# EAGLE design XT-01_Power (EAGLE 9.5.1)
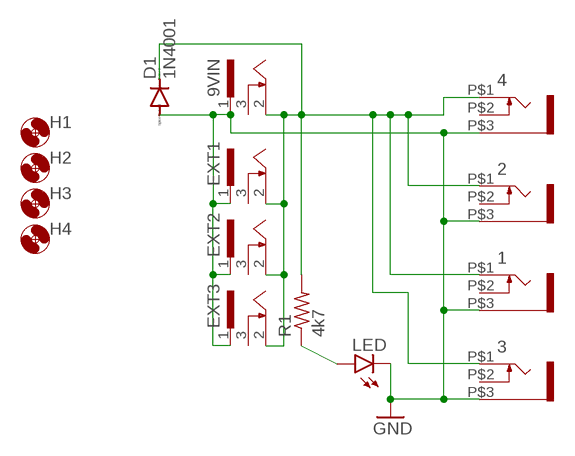
[diagram p0: schematic, sheet 1]

## Parts
1  WQP-PJ301M-12_JACK  [WQP-PJ301M-12_JACK]
2  WQP-PJ301M-12_JACK  [WQP-PJ301M-12_JACK]
3  WQP-PJ301M-12_JACK  [WQP-PJ301M-12_JACK]
4  WQP-PJ301M-12_JACK  [WQP-PJ301M-12_JACK]
9VIN  SCD-014A  [SCD-014-A]
D1  1N4001  1N4004  [DO41-10]
EXT1  SCD-014A  [SCD-014-A]
EXT2  SCD-014A  [SCD-014-A]
EXT3  SCD-014A  [SCD-014-A]
H1  MOUNT-HOLE3.0  [3,0]
H2  MOUNT-HOLE3.0  [3,0]
H3  MOUNT-HOLE3.0  [3,0]
H4  MOUNT-HOLE3.0  [3,0]
LED  LED3MM  [LED3MM]
R1  4k7  R-US_0207/7  [0207/7]

## Nets
GND: 1.P$3 2.P$3 3.P$3 4.P$3 9VIN.1 D1.A EXT1.1 EXT2.1 EXT3.1 LED.K(C)
N$1: LED.A R1.1
N$2: 1.P$1 2.P$1 3.P$1 4.P$1 9VIN.2 D1.C EXT1.2 EXT2.2 EXT3.2 R1.2
Unconnected: 1.P$2 2.P$2 3.P$2 4.P$2 9VIN.3 EXT1.3 EXT2.3 EXT3.3

## Library data of the parts
1-4 = thonkiconn:WQP-PJ301M-12_JACK
9VIN EXT1-EXT3 = con-shiua-chyuan:SCD-014A: Power Jack 2.5mm; OC_FARNELL: unknown; OC_NEWARK: unknown
D1 = diode:1N4004: DIODE general purpose rectifier, 1 A
H1-H4 = holes:MOUNT-HOLE: MOUNTING HOLE with drill center marker
LED = led:LED: LED OSRAM: - CHIPLED LG R971, LG N971, LY N971, LG Q971, LY Q971, LO R971, LY R971 LH N974, LH R974 LS Q976, LO Q976, LY Q976 LO Q996 - Hyper CHIPLED LW Q18S LB Q993, LB Q99A, LB R99A - SideLED LS A670, LO A670, LY A670, LG A670, LP A670 LB A673, LV A673, LT A673, LW A673 LH A674 LY A675 LS A676, LA A676, LO A676, LY A676, LW A676 LS A679, LY A679, LG A679 - Hyper Micro SIDELED® LS Y876, LA Y876, LO Y876, LY Y876 LT Y87S - SmartLED LW L88C, LW L88S LB L89C, LB L89S, LG L890 LS L89K, LO L89K, LY L89K LS L896, LA L896, LO L896, LY L896 - TOPLED LS T670, LO T670, LY T670, LG T670, LP T670 LSG T670, LSP T670, LSY T670, LOP T670, LYG T670 LG T671, LOG T671, LSG T671 LB T673, LV T673, LT T673, LW T673 LH T674 LS T676, LA T676, LO T676, LY T676, LB T676, LH T676, LSB T676, LW T676 LB T67C, LV T67C, LT T67C, LS T67K, LO T67K, LY T67K, LW E67C LS E67B, LA E67B, LO E67B, LY E67B, LB E67C, LV E67C, LT E67C LW T67C LS T679, LY T679, LG T679 LS T770, LO T770, LY T770, LG T770, LP T770 LB T773, LV T773, LT T773, LW T773 LH T774 LS E675, LA E675, LY E675, LS T675 LS T776, LA T776, LO T776, LY T776, LB T776 LHGB T686 LT T68C, LB T68C - Hyper Mini TOPLED® LB M676 - Mini TOPLED Santana® LG M470 LS M47K, LO M47K, LY M47K Source: http://www.osram.convergy.de LUXEON: - LUMILED® LXK2-PW12-R00, LXK2-PW12-S00, LXK2-PW14-U00, LXK2-PW14-V00 LXK2-PM12-R00, LXK2-PM12-S00, LXK2-PM14-U00 LXK2-PE12-Q00, LXK2-PE12-R00, LXK2-PE12-S00, LXK2-PE14-T00, LXK2-PE14-U00 LXK2-PB12-K00, LXK2-PB12-L00, LXK2-PB12-M00, LXK2-PB14-N00, LXK2-PB14-P00, LXK2-PB14-Q00 LXK2-PR12-L00, LXK2-PR12-M00, LXK2-PR14-Q00, LXK2-PR14-R00 LXK2-PD12-Q00, LXK2-PD12-R00, LXK2-PD12-S00 LXK2-PH12-R00, LXK2-PH12-S00 LXK2-PL12-P00, LXK2-PL12-Q00, LXK2-PL12-R00 Source: www.luxeon.com KINGBRIGHT: KA-3528ASYC Source: www.kingbright.com
R1 = rcl:R-US_: RESISTOR, American symbol; SPICEPREFIX: R

## Board
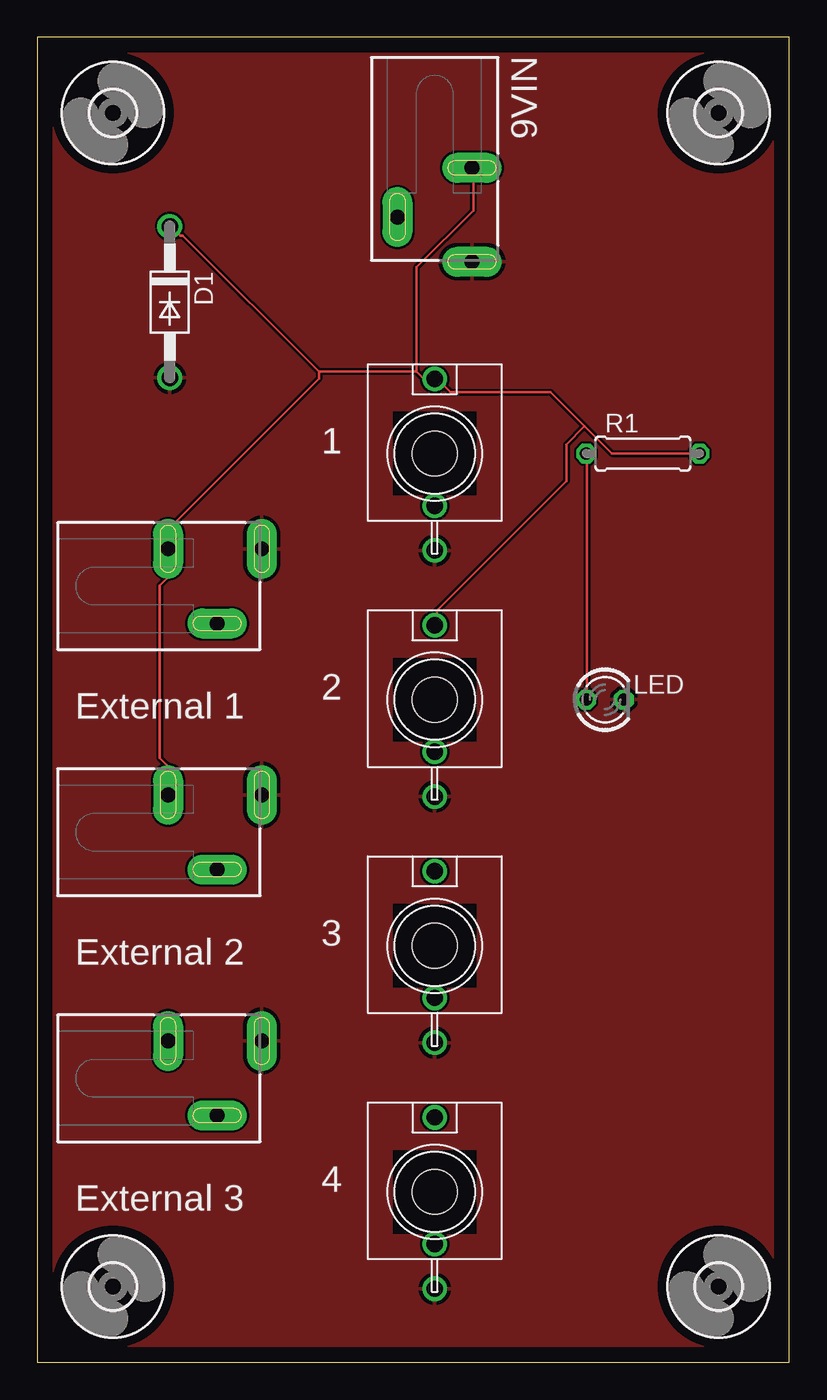
[diagram p1: board, top side]
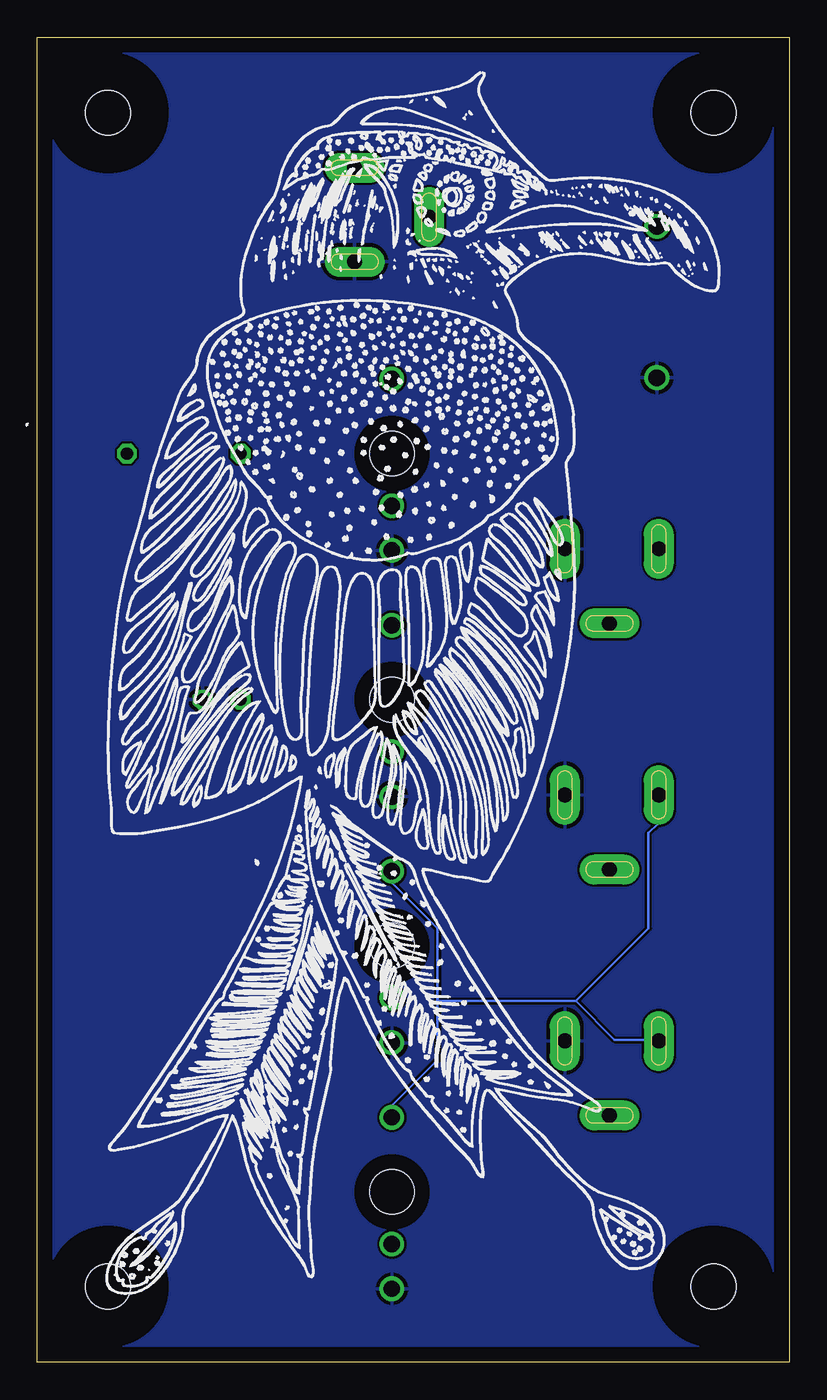
[diagram p2: board, bottom side, seen from below]

Size 50.47 x 88.89 mm. Coordinates in mm from the lower left corner, seen from the top.
Outline: 0,0 50.47,0 50.47,88.89 0,88.89 0,0
Copper layers (1*16): Top 0.035mm / dielectric 1.5mm / Bottom 0.035mm
Design rules "default": minimum track width 6mil, minimum drill 0.35mm, track to track 6mil, track to pad 6mil, pad to pad 6mil, via to via 6mil, smd to smd 6mil, copper to edge 40mil, drill to drill 6mil, minimum pad ring 10mil, minimum via ring 8mil, stop-mask expansion 4mil, vias tented up to drill 0mil, thermal gap 10mil
Holes 3 mm at 26.67,60.96 26.67,44.45 26.67,27.94 26.67,11.43

### Footprints (pad centres in the part's own frame; a part is rotated, then mirrored left to right if it is on the bottom)
WQP-PJ301M-12_JACK = drill 1.1: P$1 0,5; P$2 0,-3.5; P$3 0,-6.5
SCD-014-A = drill 1 pad 2 long: 1 -2.5,13.8; 2 -2.5,7.5; 3 2.5,10.8
DO41-10 = drill 1.118: A 5.08,0; C -5.08,0
3,0 = hole 3: 0,0
LED3MM = drill 0.813 octagon: A -1.27,0; K 1.27,0
0207/7 = drill 0.813 octagon: 1 -3.81,0; 2 3.81,0

### Placement (x,y rotation side)
1  26.67,60.96 0 top
2  26.67,44.45 0 top
3  26.67,27.94 0 top
4  26.67,11.43 0 top
9VIN  26.67,87.63 180 top
D1  8.89,71.12 270 top
EXT1  1.27,52.07 270 top
EXT2  1.27,35.56 270 top
EXT3  1.27,19.05 270 top
H1  5.08,5.08 0 top
H2  45.72,5.08 0 top
H3  5.08,83.82 0 top
H4  45.72,83.82 0 top
LED  38.1,44.45 0 top
R1  40.64,60.96 0 top

### Tracks (layer width: path | path; a pad name or v marks a point on that pad's centre or on a via)
GND
  pour Top: 0,88.9 50.8,88.9 50.8,0 0,0
  pour Bottom: 0,88.9 50.8,88.9 50.8,0 0,0
N$1
  Top 0.152: LED.A 36.88,44.5 36.88,60.96 R1.1
N$2
  Top 0.152: R1.2 38.56,60.96 36.73,62.79 | 36.73,62.79 34.44,65.08 27.74,65.08 26.98,65.84 26.67,65.84 1.P$1 26.67,65.99 25.91,65.99 25.45,66.45 | 2.P$1 26.67,50.14 26.82,50.29 26.82,50.44 35.51,59.13 35.51,61.57 36.73,62.79 | 18.9,66.45 9.75,75.59 9.6,75.59 8.99,76.2 D1.C | 25.45,66.45 18.9,66.45 | 18.9,66.45 18.9,65.99 8.84,55.93 8.84,54.71 EXT1.2 8.69,54.56 8.69,52.58 8.23,52.12 8.23,40.54 8.69,40.08 8.69,38.1 EXT2.2 | 25.45,66.45 25.45,73.46 29.26,77.27 29.26,80.01 9VIN.2
  Bottom 0.152: 4.P$1 26.67,17.22 23.62,20.27 23.62,24.23 | 23.62,24.23 23.62,29.11 26.67,32.16 3.P$1 | 14.33,24.23 11.73,21.64 8.84,21.64 EXT3.2 | 23.62,24.23 14.33,24.23 | 14.33,24.23 9.45,29.11 9.45,35.51 8.84,36.12 8.84,37.95 EXT2.2

### Text on the board
tNames: 1 | 2 | External 1 | 3 | External 2 | 4 | External 3
tValues: VauxFlores XT-01 Power/Mult